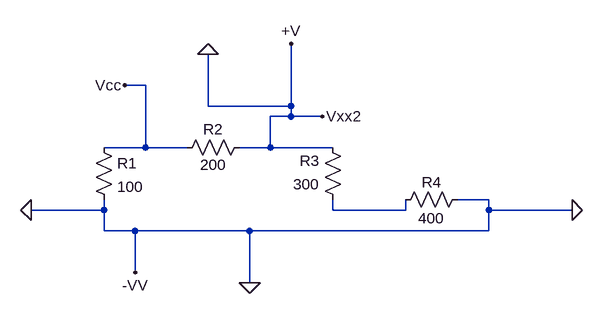
[diagram p0: schematic 05- Flags.asc]
05- Flags.asc, the LTspice schematic file:
Version 4.1
SHEET 1 880 680
WIRE 160 32 128 32
WIRE 256 64 256 -16
WIRE 384 64 384 -32
WIRE 384 64 256 64
WIRE 384 80 384 64
WIRE 384 80 352 80
WIRE 432 80 384 80
WIRE 160 128 160 32
WIRE 160 128 96 128
WIRE 224 128 160 128
WIRE 352 128 352 80
WIRE 352 128 304 128
WIRE 448 128 352 128
WIRE 688 208 640 208
WIRE 96 224 96 208
WIRE 96 224 -16 224
WIRE 448 224 448 208
WIRE 560 224 560 208
WIRE 560 224 448 224
WIRE 688 224 688 208
WIRE 816 224 688 224
WIRE 96 256 96 224
WIRE 144 256 96 256
WIRE 320 256 144 256
WIRE 688 256 688 224
WIRE 688 256 320 256
WIRE 144 320 144 256
WIRE 320 336 320 256
FLAG 128 32 Vcc
FLAG 432 80 Vxx2
FLAG 384 -32 +V
FLAG 144 320 -VV
FLAG 320 336 0
FLAG 816 224 0
FLAG 256 -16 0
FLAG -16 224 0
SYMBOL res 80 112 R0
SYMATTR InstName R1
SYMATTR Value 100
SYMBOL res 320 112 R90
WINDOW 0 3 56 VBottom 2
WINDOW 3 27 56 VTop 2
SYMATTR InstName R2
SYMATTR Value 200
SYMBOL res 464 224 R180
WINDOW 0 36 76 Left 2
WINDOW 3 36 40 Left 2
SYMATTR InstName R3
SYMATTR Value 300
SYMBOL res 544 224 R270
WINDOW 0 27 56 VTop 2
WINDOW 3 3 56 VBottom 2
SYMATTR InstName R4
SYMATTR Value 400

The netlist it stands for:
* 05- Flags.asc
R1 Vcc 0 100
R2 0 Vcc 200
R3 N001 0 300
R4 N001 0 400
.backanno
.end